# EAGLE design quadrature (EAGLE 6.6.0)
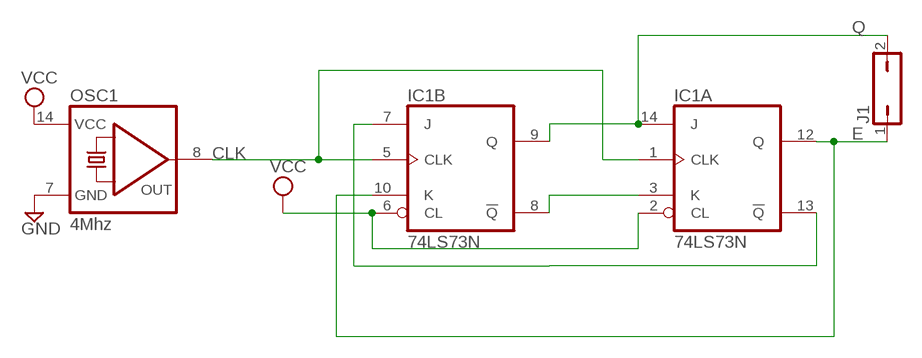
[diagram p0: schematic, sheet 1]

## Parts
IC1  74LS73N  [DIL14]
J1  JP1Q  [JP1]
OSC1  4Mhz  QG5860  [DIL14S]

## Nets
CLK: IC1.1(A:CLK) IC1.5(B:CLK) OSC1.8(OUT)
E: IC1.10(B:K) IC1.12(A:Q) J1.1
GND: OSC1.7(GND)
N$1: IC1.3(A:K) IC1.8(B:!Q)
N$2: IC1.7(B:J) IC1.13(A:!Q)
Q: IC1.9(B:Q) IC1.14(A:J) J1.2
VCC: IC1.2(A:CL) IC1.6(B:CL) OSC1.14(VCC)

## Power pins joined to a net without a drawn wire
GND: IC1.11(P:GND)
VCC: IC1.4(P:VCC)

## Library data of the parts
IC1 = 74xx-us:74*73: Dual J-K FLIP FLOP, clear
J1 = jumper:JP1Q: JUMPER
OSC1 = crystal:QG5860: CRYSTAL RESONATOR; OC_FARNELL: unknown; OC_NEWARK: unknown

## Board
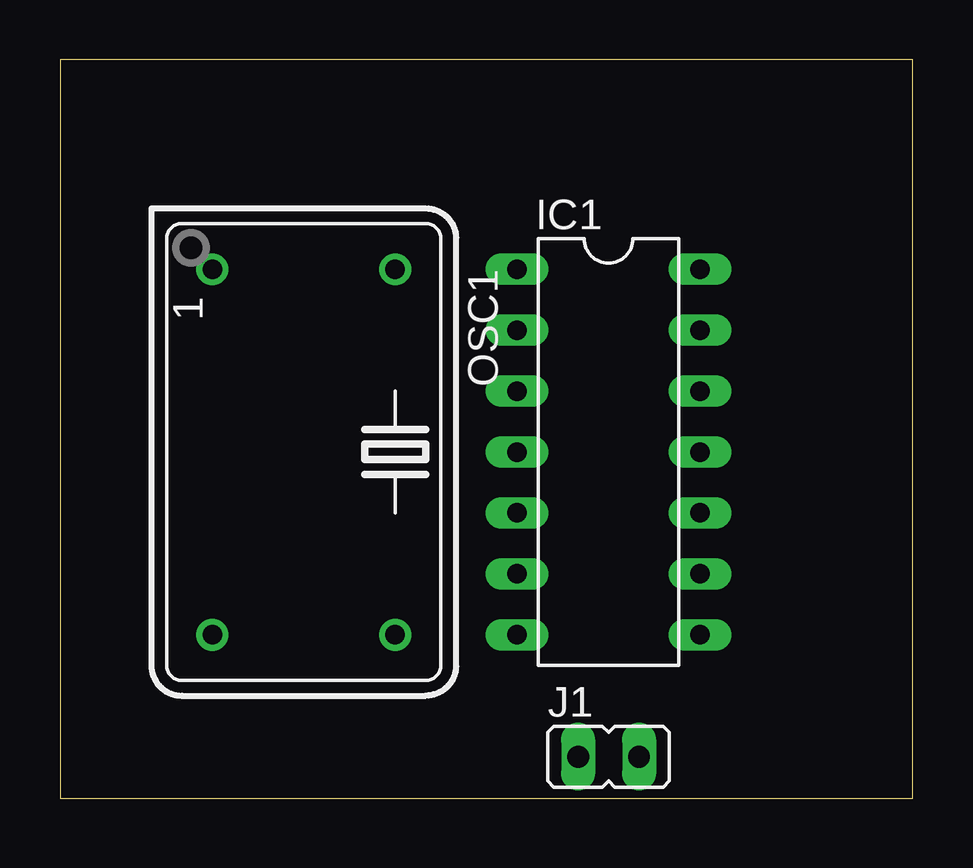
[diagram p1: board, top side]
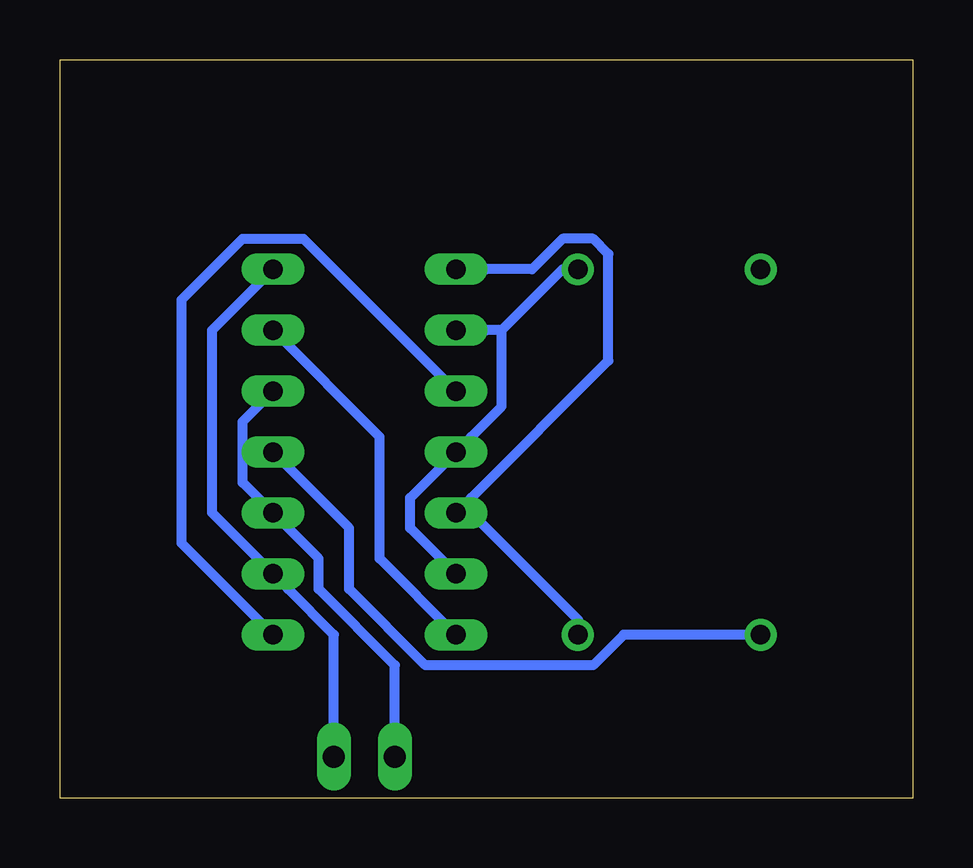
[diagram p2: board, bottom side, seen from below]

Size 35.54 x 30.79 mm. Coordinates in mm from the lower left corner, seen from the top.
Outline: 0,0 35.54,0 35.54,30.79 0,30.79 0,0
Copper layers (1+16): Top 0.035mm / dielectric 1.5mm / Bottom 0.035mm
Design rules "16mils": minimum track width 16mil, minimum drill 32mil, track to track 15mil, track to pad 10mil, pad to pad 10mil, via to via 10mil, smd to smd 10mil, copper to edge 13mil, drill to drill 10mil, minimum pad ring 10mil, minimum via ring 8mil, stop-mask expansion 0mil, vias tented up to drill 0mil, thermal gap 10mil

### Footprints (pad centres in the part's own frame; a part is rotated, then mirrored left to right if it is on the bottom)
DIL14 = drill 0.813 long: 1 -7.62,-3.81; 2 -5.08,-3.81; 3 -2.54,-3.81; 4 0,-3.81; 5 2.54,-3.81; 6 5.08,-3.81; 7 7.62,-3.81; 8 7.62,3.81; 9 5.08,3.81; 10 2.54,3.81; 11 0,3.81; 12 -2.54,3.81; 13 -5.08,3.81; 14 -7.62,3.81
JP1 = drill 0.914 long: 1 0,-1.27; 2 0,1.27
DIL14S = drill 0.813: 1 -7.62,-3.81; 7 7.62,-3.81; 8 7.62,3.81; 14 -7.62,3.81

### Placement (x,y rotation side)
IC1  22.86,14.44 270 top
J1  22.86,1.74 270 top
OSC1  10.15,14.44 270 top

### Tracks (layer width: path | path; a pad name or v marks a point on that pad's centre or on a via)
CLK
  Bottom 0.406: OSC1.8 13.96,7.46 18.41,11.9 IC1.5 18.41,12.54 12.69,18.25 12.69,22.7 13.33,23.33 14.6,23.33 15.87,22.06 17.78,22.06 IC1.1
E
  Bottom 0.406: IC1.12 27.94,15.71 27.94,13.17 IC1.10 24.76,10 24.76,8.73 21.59,5.55 J1.1
GND
  Bottom 0.406: OSC1.7 12.06,6.82 13.33,5.55 20.32,5.55 23.49,8.73 23.49,11.27 IC1.11
N$1
  Bottom 0.406: IC1.8 30.48,10.63 30.48,20.79 27.94,23.33 25.39,23.33 IC1.3
N$2
  Bottom 0.406: IC1.7 22.22,10 22.22,15.08 IC1.13
Q
  Bottom 0.406: J1.2 24.12,3.01 24.12,6.82 26.03,8.73 IC1.9 27.3,10 29.21,11.9 29.21,19.52 27.3,21.42 IC1.14
VCC
  Bottom 0.406: IC1.6 19.68,10 20.95,11.27 20.95,12.54 19.68,13.81 IC1.4 18.41,15.08 17.14,16.34 17.14,19.52 | 17.14,19.52 14.6,22.06 OSC1.14 | 17.14,19.52 17.78,19.52 IC1.2